# Altium project ife18_TS_BMS_Master_STM32.PrjPcb
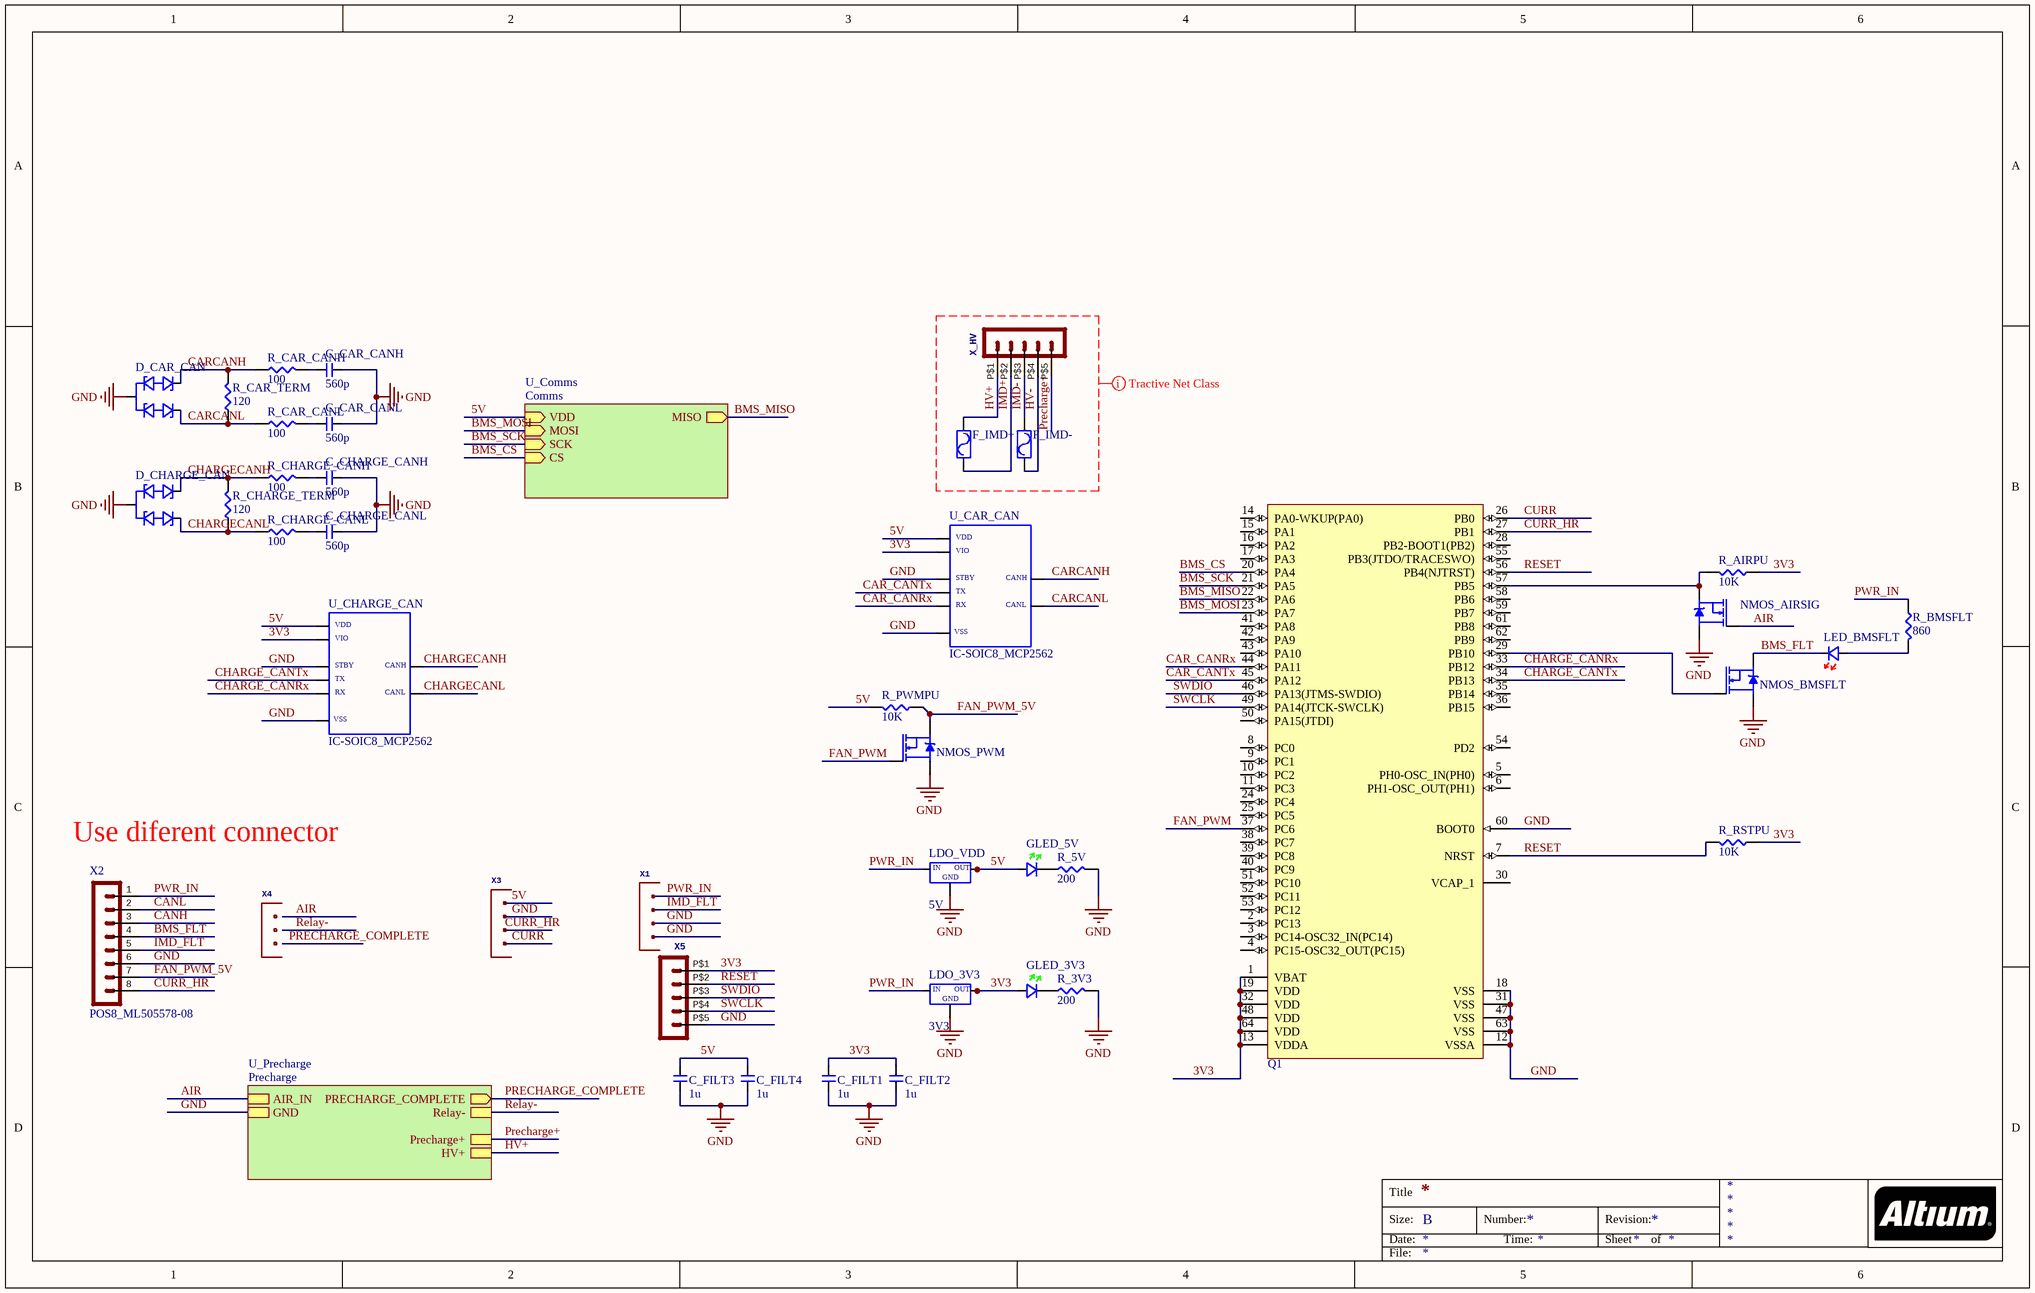
[diagram p0: ife18_TS_BMS_Master.SchDoc]
3 sheets, 69 parts. Net scope: hierarchical (ports join the sheet entries above them; power ports are global).
Board file: ife18_TS_BMS_Master_STM32.PcbDoc
Sheets:
  ife18_TS_BMS_Master.SchDoc
    U_Comms = Comms.SchDoc
    U_Precharge = Precharge.SchDoc

## Sheet ife18_TS_BMS_Master.SchDoc
size B

### Parts
C_CAR_CANH  560p  [CAP-0603]
C_CAR_CANL  560p  [CAP-0603]
C_CHARGE_CANH  560p  [CAP-0603]
C_CHARGE_CANL  560p  [CAP-0603]
C_FILT1  1u  [CAP-0603]
C_FILT2  1u  [CAP-0603]
C_FILT3  1u  [CAP-0603]
C_FILT4  1u  [CAP-0603]
D_CAR_CAN  DIODE-SOT23_PESD1CAN  [SOT23]  (value not drawn)
D_CHARGE_CAN  DIODE-SOT23_PESD1CAN  [SOT23]  (value not drawn)
F_IMD+  FUSE_885  [FUSE_885]  (value not drawn)
F_IMD-  FUSE_885  [FUSE_885]  (value not drawn)
GLED_3V3  (no value)  [LEDGREEN-0603]
GLED_5V  (no value)  [LEDGREEN-0603]
LDO_3V3  3V3  [SOT223]
LDO_VDD  5V  [SOT223]
LED_BMSFLT  LEDRED-0603  [LEDRED-0603]  (value not drawn)
NMOS_AIRSIG  NMOS-SOT23  [SOT23]  (value not drawn)
NMOS_BMSFLT  NMOS-SOT23  [SOT23]  (value not drawn)
NMOS_PWM  NMOS-SOT23  [SOT23]  (value not drawn)
Q1  STM32F446RET6  [TSQFP50P1200X1200X160-64N]  (value not drawn)
R_3V3  200  [RES-0603]
R_5V  200  [RES-0603]
R_AIRPU  10K  [RES-0603]
R_BMSFLT  860  [RES-0603]
R_CAR_CANH  100  [RES-0603]
R_CAR_CANL  100  [RES-0603]
R_CAR_TERM  120  [RES-0603]
R_CHARGE_CANH  100  [RES-0603]
R_CHARGE_CANL  100  [RES-0603]
R_CHARGE_TERM  120  [RES-0603]
R_PWMPU  10K  [RES-0603]
R_RSTPU  10K  [RES-0603]
U_CAR_CAN  IC-SOIC8_MCP2562  [SOIC8]
U_CHARGE_CAN  IC-SOIC8_MCP2562  [SOIC8]
X1  Molex 505575-04 4 Position 2.00mm pitch connector wire to board connector Datasheet  [505578-04]  (value not drawn)
X2  POS8_ML505578-08  [505575-08]
X3  Molex 505575-04 4 Position 2.00mm pitch connector wire to board connector Datasheet  [505578-04]  (value not drawn)
X4  Molex 505575-03 3 Position 2.00mm pitch connector wire to board connector Datasheet  [505578-03]  (value not drawn)
X5  (no value)  [POS5_254MM_MALE]
X_HV  Molex - Micro-Fit 3.0 Series connector,  3.00mm (0.118") pitch header, 5 positions.  [43650-0524]  (value not drawn)

### Sub-sheets
U_Comms = Comms: VDD (in), MOSI (in), MISO (out), SCK (in), CS (in)
U_Precharge = Precharge: PRECHARGE_COMPLETE (out), AIR_IN, GND, Precharge+, HV+, Relay-

### Nets
AIR: NMOS_AIRSIG.1(G) ; sheet U_Precharge/AIR_IN
GND: C_CAR_CANH.2 C_CAR_CANL.2 C_CHARGE_CANH.2 C_CHARGE_CANL.2 C_FILT1.1 C_FILT2.1 C_FILT3.1 C_FILT4.1 D_CAR_CAN.3(G) D_CHARGE_CAN.3(G) LDO_3V3.1 LDO_VDD.1 NMOS_AIRSIG.2(S) NMOS_BMSFLT.2(S) NMOS_PWM.2(S) Q1.12(VSSA) Q1.18(VSS) Q1.31(VSS) Q1.47(VSS) Q1.60(BOOT0) Q1.63(VSS) R_3V3.2 R_5V.2 U_CAR_CAN.2 U_CAR_CAN.8 U_CHARGE_CAN.2 U_CHARGE_CAN.8 X1.3 X1.4 X2.6 X3.2 X5.P$5 ; sheet U_Precharge/GND
3V3: C_FILT1.2 C_FILT2.2 GLED_3V3.A LDO_3V3.2 LDO_3V3.4 Q1.1(VBAT) Q1.13(VDDA) Q1.19(VDD) Q1.32(VDD) Q1.48(VDD) Q1.64(VDD) R_AIRPU.1 R_RSTPU.1 U_CAR_CAN.5 U_CHARGE_CAN.5 X5.P$1
5V: C_FILT3.2 C_FILT4.2 GLED_5V.A LDO_VDD.2 LDO_VDD.4 R_PWMPU.1 U_CAR_CAN.3 U_CHARGE_CAN.3 X3.1 ; sheet U_Comms/VDD
BMS_CS: Q1.20(PA4) ; sheet U_Comms/CS
BMS_FLT: LED_BMSFLT.K NMOS_BMSFLT.3(D) X2.4
BMS_MISO: Q1.22(PA6) ; sheet U_Comms/MISO
BMS_MOSI: Q1.23(PA7) ; sheet U_Comms/MOSI
BMS_SCK: Q1.21(PA5) ; sheet U_Comms/SCK
CANH: X2.3
CANL: X2.2
CAR_CANRx: Q1.44(PA11) U_CAR_CAN.4
CAR_CANTx: Q1.45(PA12) U_CAR_CAN.1
CARCANH: D_CAR_CAN.2(CAN2) R_CAR_CANH.1 R_CAR_TERM.2 U_CAR_CAN.7
CARCANL: D_CAR_CAN.1(CAN1) R_CAR_CANL.1 R_CAR_TERM.1 U_CAR_CAN.6
CHARGE_CANRx: Q1.33(PB12) U_CHARGE_CAN.4
CHARGE_CANTx: Q1.34(PB13) U_CHARGE_CAN.1
CHARGECANH: D_CHARGE_CAN.2(CAN2) R_CHARGE_CANH.1 R_CHARGE_TERM.2 U_CHARGE_CAN.7
CHARGECANL: D_CHARGE_CAN.1(CAN1) R_CHARGE_CANL.1 R_CHARGE_TERM.1 U_CHARGE_CAN.6
CURR: Q1.26(PB0) X3.4
CURR_HR: Q1.27(PB1) X2.8 X3.3
FAN_PWM: NMOS_PWM.1(G) Q1.37(PC6)
FAN_PWM_5V: NMOS_PWM.3(D) R_PWMPU.2 X2.7
HV+: F_IMD+.1 X_HV.P$1 ; sheet U_Precharge/HV+
HV-: F_IMD-.2 X_HV.P$4
IMD+: F_IMD+.2 X_HV.P$2
IMD-: F_IMD-.1 X_HV.P$3
IMD_FLT: X1.2 X2.5
Precharge+: X_HV.P$5 ; sheet U_Precharge/Precharge+
PWR_IN: LDO_3V3.3 LDO_VDD.3 R_BMSFLT.2 X1.1 X2.1
RESET: Q1.7(NRST) Q1.56(PB4(NJTRST)) R_RSTPU.2 X5.P$2
SWCLK: Q1.49(PA14(JTCK-SWCLK)) X5.P$4
SWDIO: Q1.46(PA13(JTMS-SWDIO)) X5.P$3
NetC_CAR_CANH_1: C_CAR_CANH.1 R_CAR_CANH.2
NetC_CAR_CANL_1: C_CAR_CANL.1 R_CAR_CANL.2
NetC_CHARGE_CANH_1: C_CHARGE_CANH.1 R_CHARGE_CANH.2
NetC_CHARGE_CANL_1: C_CHARGE_CANL.1 R_CHARGE_CANL.2
NetGLED_3V3_K: GLED_3V3.K R_3V3.1
NetGLED_5V_K: GLED_5V.K R_5V.1
NetLED_BMSFLT_A: LED_BMSFLT.A R_BMSFLT.1
NetNMOS_AIRSIG_3: NMOS_AIRSIG.3(D) Q1.57(PB5) R_AIRPU.2
NetNMOS_BMSFLT_1: NMOS_BMSFLT.1(G) Q1.29(PB10)

Not connected (* = marked no-connect by the designer): Q1 2(PC13) 3(PC14-OSC32_IN(PC14)) 4(PC15-OSC32_OUT(PC15)) 5(PH0-OSC_IN(PH0)) 6(PH1-OSC_OUT(PH1)) 8(PC0) 9(PC1) 10(PC2) 11(PC3) 14(PA0-WKUP(PA0)) 15(PA1) 16(PA2) 17(PA3) 24(PC4) 25(PC5) 28(PB2-BOOT1(PB2)) 30(VCAP_1) 35(PB14) 36(PB15) 38(PC7) 39(PC8) 40(PC9) 41(PA8) 42(PA9) 43(PA10) 50(PA15(JTDI)) 51(PC10) 52(PC11) 53(PC12) 54(PD2) 55(PB3(JTDO/TRACESWO)) 58(PB6) 59(PB7) 61(PB8) 62(PB9); X4 1 2 3

### Layout directives
net class Tractive: HV+, HV-, IMD+, IMD-, Precharge+

### Notes on the sheet
- Use diferent connector
- Title
- Size:
- Date:
- B
- Number:
- Time:
- Revision:
- Sheet
- of
- File:
- (in symbol IC-SOIC8_MCP2562) VDD; VIO; STBY; CANH; TX; RX; CANL; VSS
- (in symbol LDO-SOT223_SPX1117) IN; OUT; GND

### Library data of the parts
C_CAR_CANH C_CAR_CANL C_CHARGE_CANH C_CHARGE_CANL C_FILT1-C_FILT4 = CAP-0603
GLED_3V3 GLED_5V = LEDGREEN-0603
LDO_3V3 LDO_VDD = LDO-SOT223_SPX1117
Q1 = IC-LQFP64_STM32F446RET6: IC MCU 32BIT 512KB FLASH 64LQFP; Manufacturer: STMicroelectronics; Frequency: 180MHz; Number of I/Os: 50; RAM Size: 132KB; Min Supply Voltage: 1.7V; Max Supply Voltage: 3.6V; Core Architecture: ARM; Interface: CAN,EBI/EMI,I2C,I2S,IrDA,LIN,SD,SPI,UART,USART,USB; Oscillator Type: Internal; Peripherals: Brown-out Detect/Reset,DMA,LVD,POR,PWM,WDT; Data Bus Width: 32b; Number of Timers/Counters: 14; Watchdog Timer: Yes; Max Power Dissipation: 345mW; Supplier 1: Digi-Key; Manufacturer Part Number: STM32F446RET6; Stock 1: 9529; Pricing 1: 1 = 8.59000, 10 = 7.76200, 160 = 6.42581, 640 = 5.59550, 1120 = 4.87350 (USD); RoHS: Yes; Mount: Surface Mount; Case/Package: LQFP; Number of Pins: 64; Min Operating Temperature: -40°C; Max Operating Temperature: 85°C; Memory Size: 512KB; Packaging: Tray; Memory Type: FLASH; Max Frequency: 180MHz; Number of Programmable I/O: 50; REACH SVHC: No SVHC; Lead Free: Lead Free
R_3V3 R_5V R_AIRPU R_BMSFLT R_CAR_CANH R_CAR_CANL R_CAR_TERM R_CHARGE_CANH R_CHARGE_CANL R_CHARGE_TERM R_PWMPU R_RSTPU = RES-0603
X1 X3 = POS4_ML505578-04: GateName_1: G$1; SymbolName_1: 4POS; LibraryName: MOLEX Micro-Lock; DeviceSetName: 505575-04; Package: 505575-04
X2 = POS8_ML505578-08: Manufacturer: Molex; Manufacturer Part Number: 172065-0308; Supplier 1: Digikey; Stock 1: 323; Pricing 1: 1 = 9.17000, 68 = 7.57265, 136 = 7.37338, 544 = 6.17768, 1020 = 5.46027 (USD); ComponentLink1URL: http://datasheet.octopart.com/172065-0308-Molex-datasheet-101610459.pdf?src-supplier=Farnell; ComponentLink1Description: http://datasheet.octopart.com/172065-0308-Molex-datasheet-101610459.pdf?src-supplier=Farnell; ComponentLink2URL: http://datasheet.octopart.com/172065-0308-Molex-datasheet-96710946.pdf?src-supplier=Farnell; ComponentLink2Description: http://datasheet.octopart.com/172065-0308-Molex-datasheet-96710946.pdf?src-supplier=Farnell
X4 = POS3_ML505578-03: GateName_1: G$1; SymbolName_1: 3POS; LibraryName: MOLEX Micro-Lock; DeviceSetName: 505575-03; Package: 505575-03
X5 = POS5_254MM_MALE: GateName_1: G$1; SymbolName_1: HEADER_POS5; DeviceName: 43650-0524; DeviceSetName: HEADER_POS5_?; LibraryName: MOLEX Micro-Fit; Package: 43650-0524
X_HV = POS5_MF43650-0524: GateName_1: G$1; SymbolName_1: HEADER_POS5; DeviceSetName: HEADER_POS5_?; DeviceName: 43650-0524; LibraryName: MOLEX Micro-Fit; Package: 43650-0524

## Sheet Comms.SchDoc
size A
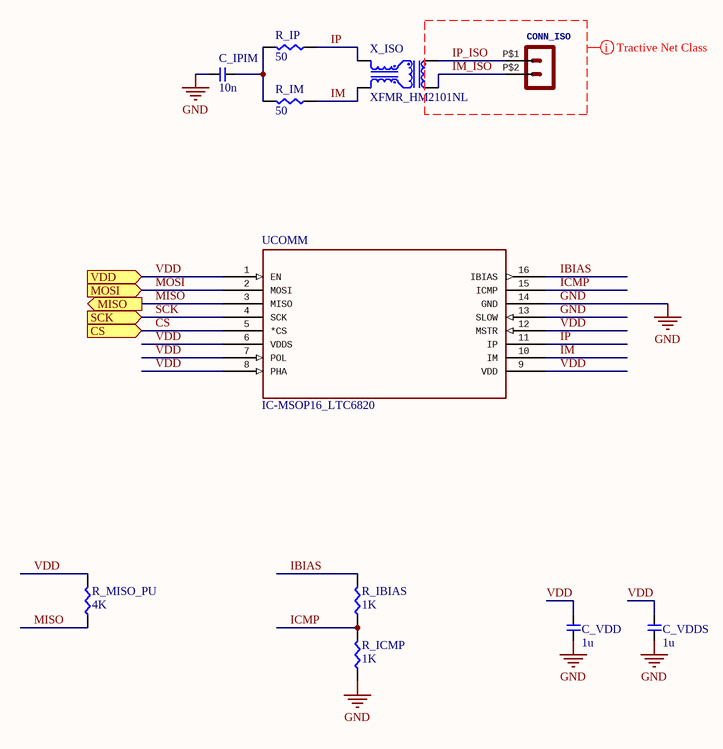
[diagram p1: Comms.SchDoc]

### Parts
(Parts that share a designator on the sheet are numbered #1, #2 ... from top to bottom, then left to right.)
C_IPIM  10n  [CAP-0603]
C_VDD#1  1u  [CAP-0603]
C_VDDS  1u  [CAP-0603]
CONN_ISO  (no value)  [43650-0224]
R_IBIAS  1K  [RES-0603]
R_ICMP  1K  [RES-0603]
R_IM  50  [RES-0603]
R_IP  50  [RES-0603]
R_MISO_PU  4K  [RES-0603]
UCOMM  IC-MSOP16_LTC6820  [MSOP16]
X_ISO  XFMR_HM2101NL  [HM2101]

### Ports
CS (in), MISO (out), MOSI (in), SCK (in), VDD (in)

### Nets
GND: C_IPIM.2 C_VDD#1.1 C_VDDS.1 R_ICMP.1 UCOMM.13(SLOW) UCOMM.14(GND)
CS: UCOMM.5(*CS) ; port CS  [project net BMS_CS]
IBIAS: R_IBIAS.2 UCOMM.16(IBIAS)
ICMP: R_IBIAS.1 R_ICMP.2 UCOMM.15(ICMP)
IM: R_IM.1 UCOMM.10(IM) X_ISO.6
IM_ISO: CONN_ISO.P$2 X_ISO.1
IP: R_IP.1 UCOMM.11(IP) X_ISO.4
IP_ISO: CONN_ISO.P$1 X_ISO.3
MISO: R_MISO_PU.1 UCOMM.3(MISO) ; port MISO  [project net BMS_MISO]
MOSI: UCOMM.2(MOSI) ; port MOSI  [project net BMS_MOSI]
SCK: UCOMM.4(SCK) ; port SCK  [project net BMS_SCK]
VDD: C_VDD#1.2 C_VDDS.2 R_MISO_PU.2 UCOMM.1(EN) UCOMM.6(VDDS) UCOMM.7(POL) UCOMM.8(PHA) UCOMM.9(VDD) UCOMM.12(MSTR) ; port VDD  [project net 5V]
NetC_IPIM_1: C_IPIM.1 R_IM.2 R_IP.2

### Layout directives
net class Tractive: IM_ISO, IP_ISO

### Library data of the parts
C_IPIM C_VDD#1 C_VDDS = CAP-0603
CONN_ISO = POS2_43650-0224: GateName_1: G$1; SymbolName_1: HEADER_POS2; DeviceSetName: HEADER_POS2_?; DeviceName: 43650-0224; LibraryName: MOLEX Micro-Fit; Package: 43650-0224
R_IBIAS R_ICMP R_IM R_IP R_MISO_PU = RES-0603

## Sheet Precharge.SchDoc: Precharge
size 241 x 127 mm; Date: 1/4/2019 10:42:01 PM; SheetNumber: 1; GateName_1: G$1; SymbolName_1: LETTER_L; LibraryName: frames; DeviceSetName: LETTER_L; GateName_2: G$2; SymbolName_2: DOCFIELD
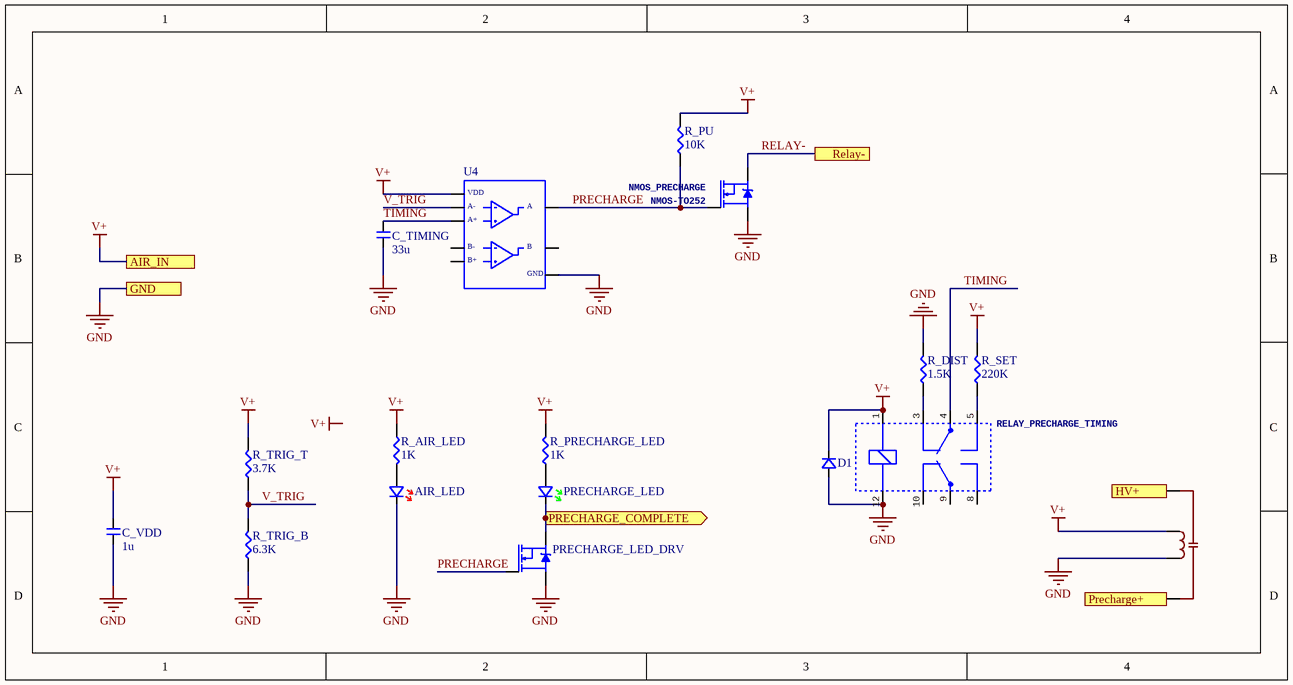
[diagram p2: Precharge.SchDoc]

### Parts
(Parts that share a designator on the sheet are numbered #1, #2 ... from top to bottom, then left to right.)
AIR_LED  (no value)  [LEDRED-0603]
C_TIMING  33u  [CAP-0603]
C_VDD#2  1u  [CAP-0603]
D1  (no value)  [DO41-10]
NMOS_PRECHARGE  NMOS-TO252  [TO252]
PRECHARGE_LED  (no value)  [LEDGREEN-0603]
PRECHARGE_LED_DRV  (no value)  [SOT23]
R_AIR_LED  1K  [RES-0603]
R_DIST  1.5K  [RES-0603]
R_PRECHARGE_LED  1K  [RES-0603]
R_PU  10K  [RES-0603]
R_SET  220K  [RES-0603]
R_TRIG_B  6.3K  [RES-0603]
R_TRIG_T  3.7K  [RES-0603]
RELAY_PRECHARGE  COTO9104  [9104-SIP4]  (value not drawn)
RELAY_PRECHARGE_TIMING  (no value)  [RELAY-DPDT_EC2]
U4  (no value)  [SOIC8]

### Ports
AIR_IN, GND, HV+, Precharge+, PRECHARGE_COMPLETE (out), Relay-

### Nets
GND: AIR_LED.K C_TIMING.1 C_VDD#2.1 D1.A NMOS_PRECHARGE.2(S) PRECHARGE_LED_DRV.2(S) R_DIST.2 R_TRIG_B.1 RELAY_PRECHARGE.5 RELAY_PRECHARGE_TIMING.12 U4.4 ; port GND
V+: C_VDD#2.2 D1.K R_AIR_LED.1 R_PRECHARGE_LED.2 R_PU.2 R_SET.2 R_TRIG_T.2 RELAY_PRECHARGE.3 RELAY_PRECHARGE_TIMING.1 U4.8 ; port AIR_IN  [project net AIR]
HV+: RELAY_PRECHARGE.1 ; port HV+
PRECHARGE: NMOS_PRECHARGE.1(G) PRECHARGE_LED_DRV.1(G) R_PU.1 U4.1
Precharge+: RELAY_PRECHARGE.7 ; port Precharge+
PRECHARGE_COMPLETE: PRECHARGE_LED.K PRECHARGE_LED_DRV.3(D) ; port PRECHARGE_COMPLETE
Relay-: NMOS_PRECHARGE.3(D) ; port Relay-
TIMING: C_TIMING.2 RELAY_PRECHARGE_TIMING.4 U4.3
V_TRIG: R_TRIG_B.2 R_TRIG_T.1 U4.2
NetAIR_LED_A: AIR_LED.A R_AIR_LED.2
NetPRECHARGE_LED_A: PRECHARGE_LED.A R_PRECHARGE_LED.1
NetR_DIST_1: R_DIST.1 RELAY_PRECHARGE_TIMING.3
NetR_SET_1: R_SET.1 RELAY_PRECHARGE_TIMING.5

Not connected (* = marked no-connect by the designer): RELAY_PRECHARGE_TIMING 8 9 10; U4 5 6 7

### Notes on the sheet
- Labels drawn without touching a wire or pin: V+
- Title
- Size:
- Date:
- A
- Number:
- Time:
- Revision:
- Sheet
- of
- File:
- (in symbol IC-SOIC8_LM393) VDD; A-; A; A+; B-; B; B+; GND

### Library data of the parts
AIR_LED = LEDRED-0603
C_TIMING C_VDD#2 = CAP-0603
D1 = DIODE-DO41-10
NMOS_PRECHARGE = NMOS-TO252: GateName_1: G$1; SymbolName_1: LABELED-PMOS; DeviceSetName: DMP10H400SK3-13; LibraryName: IFE_Transistors; Package: TO252
PRECHARGE_LED = LEDGREEN-0603
PRECHARGE_LED_DRV = NMOS-SOT23
R_AIR_LED R_DIST R_PRECHARGE_LED R_PU R_SET R_TRIG_B R_TRIG_T = RES-0603
RELAY_PRECHARGE = COTO9104: GateName_1: G$1; SymbolName_1: SPST_REED; LibraryName: Discharge_Components_Altium_Export; DeviceSetName: COTO9104; Package: 9104-SIP4
RELAY_PRECHARGE_TIMING = RELAY_EC2: GateName_1: G$1; SymbolName_1: MONOSTABLERELAY; DeviceSetName: EC2; LibraryName: KEMET; Package: DPDT_2.54
U4 = IC-SOIC8_LM393

## Nets that join several sheets
AIR: ife18_TS_BMS_Master (NMOS_AIRSIG.1), Precharge (10 pins)
GND: ife18_TS_BMS_Master (32 pins), Comms (6 pins), Precharge (11 pins)
5V: ife18_TS_BMS_Master (9 pins), Comms (9 pins)
BMS_CS: ife18_TS_BMS_Master (Q1.20), Comms (UCOMM.5)
BMS_MISO: ife18_TS_BMS_Master (Q1.22), Comms (R_MISO_PU.1 UCOMM.3)
BMS_MOSI: ife18_TS_BMS_Master (Q1.23), Comms (UCOMM.2)
BMS_SCK: ife18_TS_BMS_Master (Q1.21), Comms (UCOMM.4)
HV+: ife18_TS_BMS_Master (F_IMD+.1 X_HV.P$1), Precharge (RELAY_PRECHARGE.1)
Precharge+: ife18_TS_BMS_Master (X_HV.P$5), Precharge (RELAY_PRECHARGE.7)